# Altium project mcu_board.PrjPcb
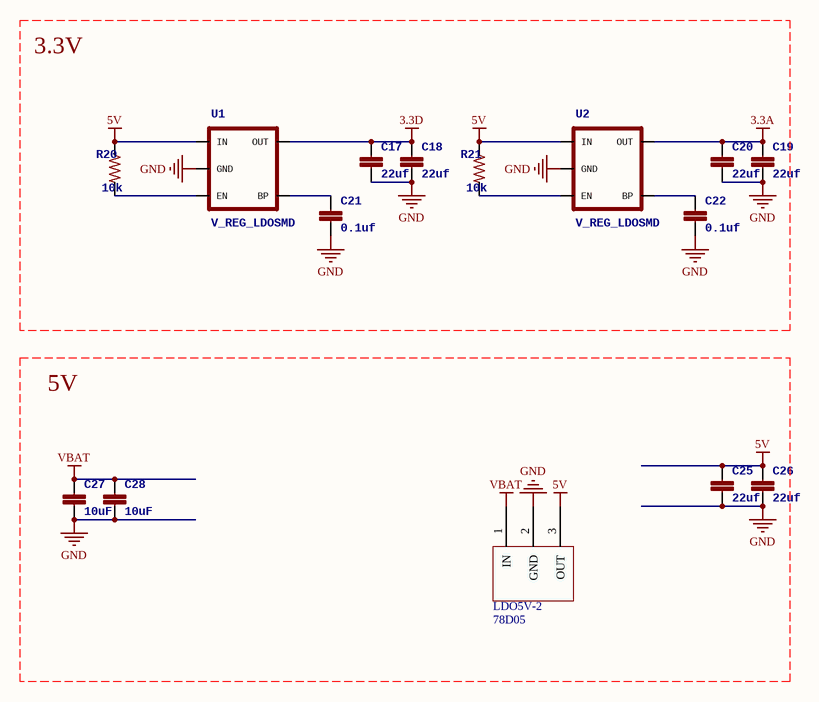
[diagram p0: power.SchDoc]
3 sheets, 75 parts. Net scope: flat (ports and power ports of the same name join across sheets).
Board file: mcu.PcbDoc
Sheets:
  power.SchDoc
  mcu.SchDoc
  interface.SchDoc

## Sheet power.SchDoc
size A4

### Parts
C17  22uf  [0805]
C18  22uf  [0805]
C19  22uf  [0805]
C20  22uf  [0805]
C21  0.1uf  [0603]
C22  0.1uf  [0603]
C25  22uf  [0805]
C26  22uf  [0805]
C27  10uF  [1206]
C28  10uF  [1206]
LDO5V-2  78D05  [TO-252-2L]
R20  10k  [0603]
R21  10k  [0603]
U1  V_REG_LDOSMD  [SOT23-5]
U2  V_REG_LDOSMD  [SOT23-5]

### Nets
3.3A: C19.1 C20.1 U2.5(OUT)
3.3D: C17.1 C18.1 U1.5(OUT)
5V: C25.1 C26.1 LDO5V-2.3(OUT) R20.1 R21.1 U1.1(IN) U2.1(IN)
GND: C17.2 C18.2 C19.2 C20.2 C21.2 C22.2 C25.2 C26.2 C27.2 C28.2 LDO5V-2.2(GND) U1.2(GND) U2.2(GND)
VBAT: C27.1 C28.1 LDO5V-2.1(IN)
NetC21_1: C21.1 U1.4(BP)
NetC22_1: C22.1 U2.4(BP)
NetR20_2: R20.2 U1.3(EN)
NetR21_2: R21.2 U2.3(EN)

### Notes on the sheet
- 3.3V
- 5V

### Library data of the parts
C17-C22 C25-C28 = CAP0402-CAP: 电容; PARTNO: CC0402ZRY5V7BB104
R20 R21 = RESISTOR0402-RES: 电阻
U1 U2 = V_REG_LDOSMD: <b>Voltage Regulator LDO</b> / Standard 150mA LDO voltage regulator in SOT-23 layout. Micrel part MIC5205. BP (by-pass) pin is used to lower output noise with 470pF cap.; PARTNO: MIC5207-3.3YM5

## Sheet mcu.SchDoc
size A4
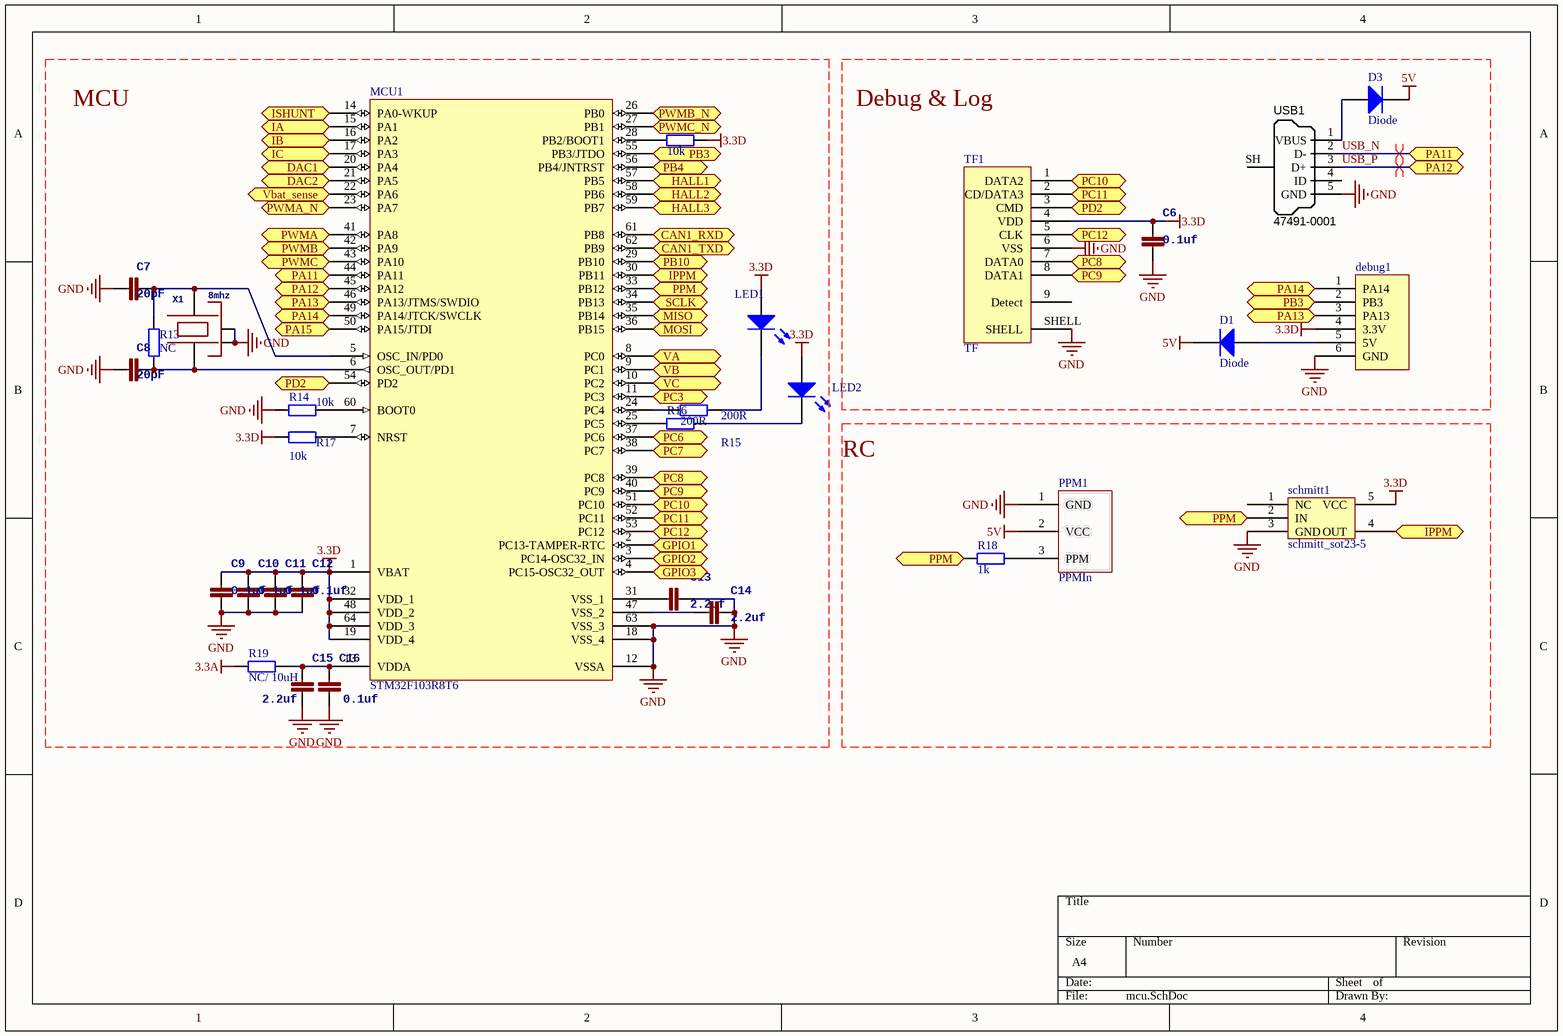
[diagram p1: mcu.SchDoc]

### Parts
C6  0.1uf  [0603]
C7  20pF  [0603]
C8  20pF  [0603]
C9  0.1uf  [0603]
C10  0.1uf  [0603]
C11  0.1uf  [0603]
C12  0.1uf  [0603]
C13  2.2uf  [0603]
C14  2.2uf  [0603]
C15  2.2uf  [0603]
C16  0.1uf  [0603]
D1  Diode  [0805]
D3  Diode  [0805]
debug1  debug  [WFRSM125]  (value not drawn)
LED1  LED0  [0603]  (value not drawn)
LED2  LED0  [0603]  (value not drawn)
MCU1  STM32F103R8T6  [LQFP64_N]
PPM1  PPMIn  [ServoConnector]
R12  10k  [0603]
R13  NC  [0603]
R14  10k  [0603]
R15  200R  [0603]
R16  200R  [0603]
R17  10k  [0603]
R18  1k  [0603]
R19  NC/ 10uH  [0603]
schmitt1  schmitt_sot23-5  [SOT23-5]
TF1  TF  [TF]
USB1  Manufacturer Part Number 1: 47491-0001  [MOLEX-47346-0001]  (hidden comment: USB Micro Type B)
X1  8mhz  [OSCILLATOR-3.2X2.5]

### Ports
CAN1_RXD, CAN1_TXD, DAC1, DAC2, GPIO1, GPIO2, GPIO3, HALL1, HALL2, HALL3, IA, IB, IC, IPPM, ISHUNT, MISO, MOSI, PA11, PA12, PA13, PA14, PA15, PB3, PB4, PB10, PC3, PC6, PC7, PC8, PC9, PC10, PC11, PC12, PD2, PPM, PWMA, PWMA_N, PWMB, PWMB_N, PWMC, PWMC_N, SCLK, VA, VB, Vbat_sense, VC

### Nets
3.3A: R19.2
3.3D: C6.2 C9.2 C10.2 C11.2 C12.2 debug1.4(3.3V) LED1.1(A) LED2.1(A) MCU1.1(VBAT) MCU1.19(VDD_4) MCU1.32(VDD_1) MCU1.48(VDD_2) MCU1.64(VDD_3) R12.2 R17.2 schmitt1.5(VCC) TF1.4(VDD)
5V: D1.2(K) D3.2(K) PPM1.2(VCC)
GND: C6.1 C7.2 C8.2 C9.1 C10.1 C11.1 C12.1 C13.2 C14.2 C15.1 C16.1 debug1.6(GND) MCU1.12(VSSA) MCU1.18(VSS_4) MCU1.63(VSS_3) PPM1.1(GND) R14.1 schmitt1.3(GND) TF1.6(VSS) TF1.SHELL USB1.5(GND) X1.2(NC_2) X1.4(NC_4)
USB_N: MCU1.44(PA11) USB1.2(D-) ; port PA11
USB_P: MCU1.45(PA12) USB1.3(D+) ; port PA12
Net*1_1: MCU1.3(PC14-OSC32_IN) ; port GPIO2
Net*1_2: MCU1.4(PC15-OSC32_OUT) ; port GPIO3
Net*1_3: MCU1.41(PA8) ; port PWMA
Net*1_4: MCU1.42(PA9) ; port PWMB
Net*1_5: MCU1.43(PA10) ; port PWMC
Net*1_6: MCU1.23(PA7) ; port PWMA_N
Net*1_7: MCU1.26(PB0) ; port PWMB_N
Net*1_8: MCU1.27(PB1) ; port PWMC_N
Net*1_9: MCU1.34(PB13) ; port SCLK
Net*1_10: MCU1.35(PB14) ; port MISO
Net*1_11: MCU1.36(PB15) ; port MOSI
Net*1_15: MCU1.17(PA3) ; port IC
Net*1_16: MCU1.16(PA2) ; port IB
Net*1_17: MCU1.15(PA1) ; port IA
Net*1_18: MCU1.14(PA0-WKUP) ; port ISHUNT
Net*1_25: MCU1.57(PB5) ; port HALL1
Net*1_26: MCU1.58(PB6) ; port HALL2
Net*1_27: MCU1.59(PB7) ; port HALL3
Net*1_28: MCU1.2(PC13-TAMPER-RTC) ; port GPIO1
NetC1_1: MCU1.8(PC0) ; port VA
NetC2_1: MCU1.9(PC1) ; port VB
NetC3_1: MCU1.10(PC2) ; port VC
NetC4_1: MCU1.22(PA6) ; port Vbat_sense
NetC7_1: C7.1 MCU1.5(OSC_IN/PD0) R13.2 X1.3
NetC8_1: C8.1 MCU1.6(OSC_OUT/PD1) R13.1 X1.1
NetC13_1: C13.1 MCU1.31(VSS_1)
NetC14_1: C14.1 MCU1.47(VSS_2)
NetC15_2: C15.2 C16.2 MCU1.13(VDDA) R19.1
NetD1_1: D1.1(A) debug1.5(5V)
NetD3_1: D3.1(A) USB1.1(VBUS)
NetDAC1_1: MCU1.20(PA4) ; port DAC1
NetDAC2_1: MCU1.21(PA5) ; port DAC2
Netdebug1_1: debug1.1(PA14) MCU1.49(PA14/JTCK/SWCLK) ; port PA14
Netdebug1_2: debug1.2(PB3) MCU1.55(PB3/JTDO) ; port PB3
Netdebug1_3: debug1.3(PA13) MCU1.46(PA13/JTMS/SWDIO) ; port PA13
NetLED1_2: LED1.2(K) R15.2
NetLED2_2: LED2.2(K) R16.2
NetMCU1_7: MCU1.7(NRST) R17.1
NetMCU1_11: MCU1.11(PC3) ; port PC3
NetMCU1_24: MCU1.24(PC4) R15.1
NetMCU1_25: MCU1.25(PC5) R16.1
NetMCU1_28: MCU1.28(PB2/BOOT1) R12.1
NetMCU1_29: MCU1.29(PB10) ; port PB10
NetMCU1_30: MCU1.30(PB11) schmitt1.4(OUT) ; port IPPM
NetMCU1_33: MCU1.33(PB12) R18.2 schmitt1.2(IN) ; port PPM
NetMCU1_37: MCU1.37(PC6) ; port PC6
NetMCU1_38: MCU1.38(PC7) ; port PC7
NetMCU1_39: MCU1.39(PC8) TF1.7(DATA0) ; port PC8
NetMCU1_40: MCU1.40(PC9) TF1.8(DATA1) ; port PC9
NetMCU1_50: MCU1.50(PA15/JTDI) ; port PA15
NetMCU1_51: MCU1.51(PC10) TF1.1(DATA2) ; port PC10
NetMCU1_52: MCU1.52(PC11) TF1.2(CD/DATA3) ; port PC11
NetMCU1_53: MCU1.53(PC12) TF1.5(CLK) ; port PC12
NetMCU1_54: MCU1.54(PD2) TF1.3(CMD) ; port PD2
NetMCU1_56: MCU1.56(PB4/JNTRST) ; port PB4
NetMCU1_60: MCU1.60(BOOT0) R14.2
NetMCU1_61: MCU1.61(PB8) ; port CAN1_RXD
NetMCU1_62: MCU1.62(PB9) ; port CAN1_TXD
NetPPM1_3: PPM1.3(PPM) R18.1

Not connected (* = marked no-connect by the designer): schmitt1 1(NC); TF1 9(Detect); USB1 4(ID) SH(Shell)

### Layout directives
differential pair: USB_N, USB_P

### Notes on the sheet
- MCU
- Debug & Log
- RC

### Library data of the parts
C6-C16 = CAP0402-CAP: 电容; PARTNO: CC0402ZRY5V7BB104
D1 D3 = Diode: Default Diode; Published: 8-Jun-2000; LatestRevisionDate: 17-Jul-2002; LatestRevisionNote: Re-released for DXP Platform.; PackageVersion: Sep-1996; PackageReference: SMC; Publisher: Altium Limited; PackageDescription: DO-214-AB/SMC; 2 C-Bend Leads; Body 7.9 x 5.9 mm, inc. leads (LxW); Code_JEDEC: DO-214-AB
LED1 LED2 = LED0: Typical INFRARED GaAs LED; Published: 8-Jun-2000; LatestRevisionDate: 08-Jul-2005; LatestRevisionNote: Mech Layer 1 removed.; PackageReference: LED-0; Publisher: Altium Limited; PackageDescription: LED; 2 Leads
MCU1 = STM32F103R8T6: STM32 ARM-based 32-bit MCU with 64 Kbytes Flash, 64-pin LQFP, Industrial Temperature; Published: *; DatasheetVersion: *; PackageVersion: *; PackageReference: *; Publisher: *; PackageDescription: *; ComponentLink1Description: *; ComponentLink1URL: *; ComponentLink2Description: *; ComponentLink2URL: *
R12-R19 = Res2: 电阻; Value: 0Ohm; Published: 8-Jun-2000; LatestRevisionDate: 17-Jul-2002; LatestRevisionNote: Re-released for DXP Platform.; PackageReference: AXIAL-0.4; Publisher: Altium Limited; PackageDescription: Axial Device, Thru-Hole; 2 Leads; 0.4 in Pin Spacing
USB1 = USB_Micro_TypeB: Connector SMD USB Micro Type B middle mount; Manufacturer 1: Molex Inc; SCDType: undef; Package / Case: SMD; Supplier 1: Digi-Key; Supplier Part Number 1: WM17142CT-ND
X1 = OSCILLATOR-3.2X2.5: Crystal Oscillator in 3.2x2.5 SMD

## Sheet interface.SchDoc
size A4
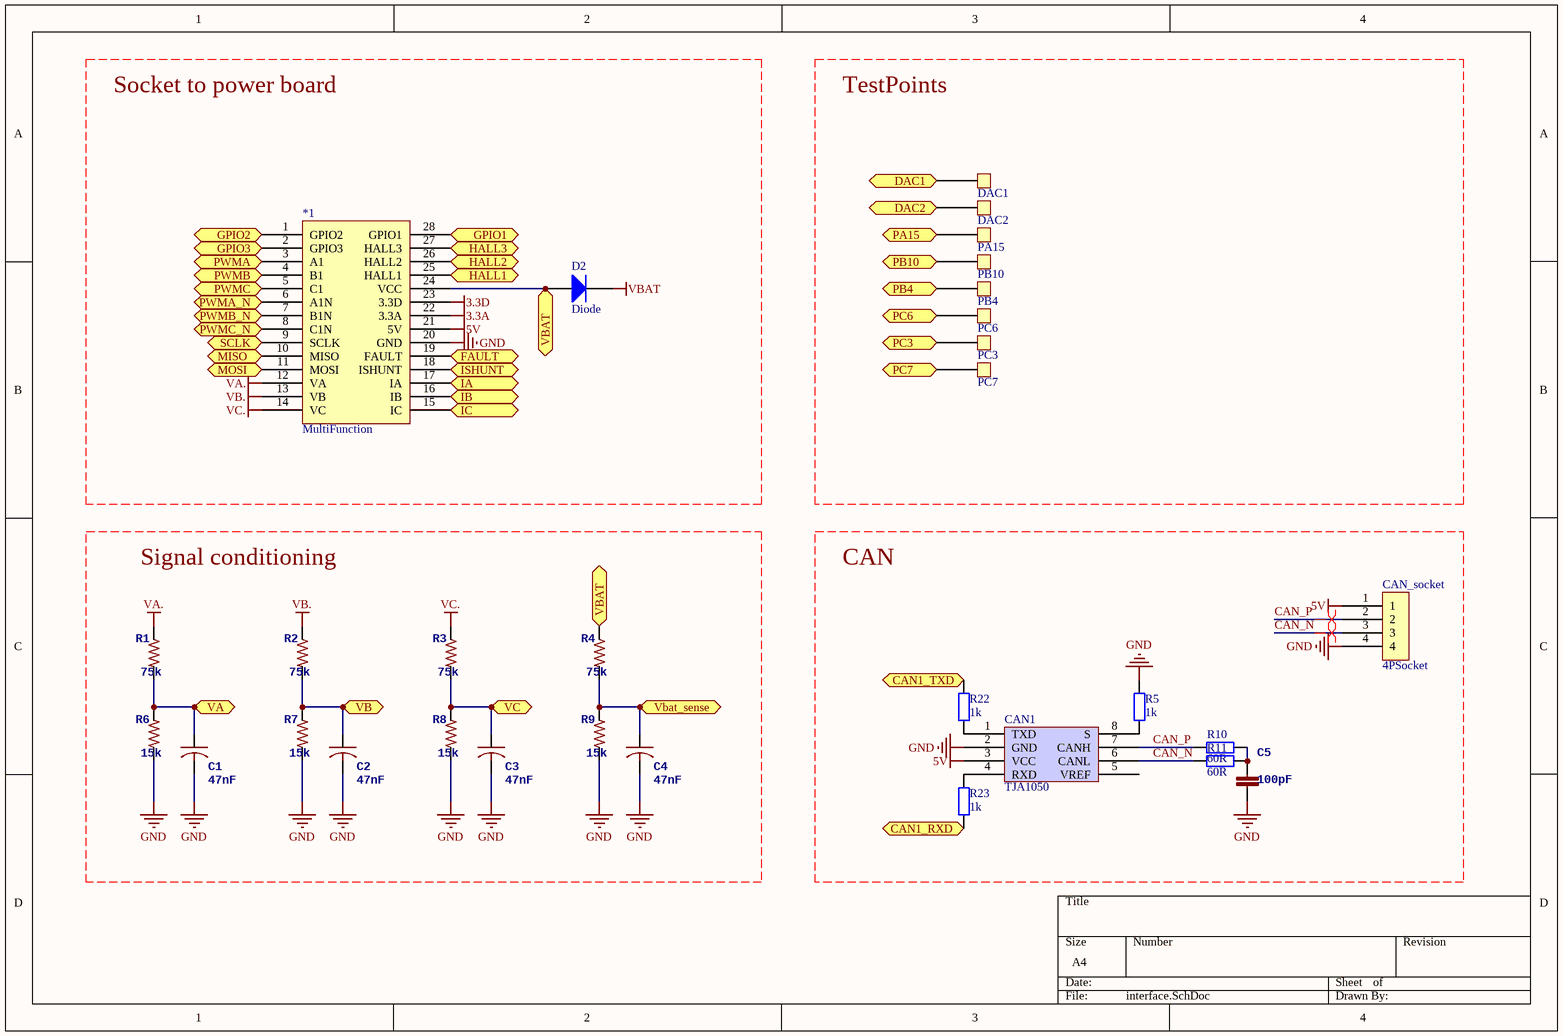
[diagram p2: interface.SchDoc]

### Parts
*1  MultiFunction  [MultiFunction]
C1  47nF  [0603]
C2  47nF  [0603]
C3  47nF  [0603]
C4  47nF  [0603]
C5  100pF  [0603]
CAN1  TJA1050  [SOIC8_39MM]
CAN_socket  4PSocket  [4pSocket]
D2  Diode  [SMA]
DAC1  TestPad  [TestPad]  (value not drawn)
DAC2  TestPad  [TestPad]  (value not drawn)
PA15  TestPad  [TestPad]  (value not drawn)
PB4  TestPad  [TestPad]  (value not drawn)
PB10  TestPad  [TestPad]  (value not drawn)
PC3  TestPad  [TestPad]  (value not drawn)
PC6  TestPad  [TestPad]  (value not drawn)
PC7  TestPad  [TestPad]  (value not drawn)
R1  75k  [0603]
R2  75k  [0603]
R3  75k  [0603]
R4  75k  [0603]
R5  1k  [0603]
R6  15k  [0603]
R7  15k  [0603]
R8  15k  [0603]
R9  15k  [0603]
R10  60R  [0603]
R11  60R  [0603]
R22  1k  [0603]
R23  1k  [0603]

### Ports
CAN1_RXD, CAN1_TXD, DAC1, DAC2, FAULT, GPIO1, GPIO2, GPIO3, HALL1, HALL2, HALL3, IA, IB, IC, ISHUNT, MISO, MOSI, PA15, PB4, PB10, PC3, PC6, PC7, PWMA, PWMA_N, PWMB, PWMB_N, PWMC, PWMC_N, SCLK, VA, VB, VBAT, Vbat_sense, VC

### Nets
3.3A: *1.22(3.3A)
3.3D: *1.23(3.3D)
5V: *1.21(5V) CAN1.3(VCC) CAN_socket.1
GND: *1.20(GND) C1.2 C2.2 C3.2 C4.2 C5.1 CAN1.2(GND) CAN_socket.4 R5.2 R6.1 R7.1 R8.1 R9.1
VA.: *1.12(VA) R1.1
VB.: *1.13(VB) R2.1
VBAT: D2.2(K)
VC.: *1.14(VC) R3.1
CAN_N: CAN1.6(CANL) CAN_socket.3 R11.2
CAN_P: CAN1.7(CANH) CAN_socket.2 R10.2
Net*1_1: *1.1(GPIO2) ; port GPIO2
Net*1_2: *1.2(GPIO3) ; port GPIO3
Net*1_3: *1.3(A1) ; port PWMA
Net*1_4: *1.4(B1) ; port PWMB
Net*1_5: *1.5(C1) ; port PWMC
Net*1_6: *1.6(A1N) ; port PWMA_N
Net*1_7: *1.7(B1N) ; port PWMB_N
Net*1_8: *1.8(C1N) ; port PWMC_N
Net*1_9: *1.9(SCLK) ; port SCLK
Net*1_10: *1.10(MISO) ; port MISO
Net*1_11: *1.11(MOSI) ; port MOSI
Net*1_15: *1.15(IC) ; port IC
Net*1_16: *1.16(IB) ; port IB
Net*1_17: *1.17(IA) ; port IA
Net*1_18: *1.18(ISHUNT) ; port ISHUNT
Net*1_19: *1.19(FAULT) ; port FAULT
Net*1_24: *1.24(VCC) D2.1(A) R4.1 ; port VBAT
Net*1_25: *1.25(HALL1) ; port HALL1
Net*1_26: *1.26(HALL2) ; port HALL2
Net*1_27: *1.27(HALL3) ; port HALL3
Net*1_28: *1.28(GPIO1) ; port GPIO1
NetC1_1: C1.1 R1.2 R6.2 ; port VA
NetC2_1: C2.1 R2.2 R7.2 ; port VB
NetC3_1: C3.1 R3.2 R8.2 ; port VC
NetC4_1: C4.1 R4.2 R9.2 ; port Vbat_sense
NetC5_2: C5.2 R10.1 R11.1
NetCAN1_1: CAN1.1(TXD) R22.1
NetCAN1_4: CAN1.4(RXD) R23.2
NetCAN1_8: CAN1.8(S) R5.1
NetDAC1_1: DAC1.1 ; port DAC1
NetDAC2_1: DAC2.1 ; port DAC2
NetMCU1_11: PC3.1 ; port PC3
NetMCU1_29: PB10.1 ; port PB10
NetMCU1_37: PC6.1 ; port PC6
NetMCU1_38: PC7.1 ; port PC7
NetMCU1_50: PA15.1 ; port PA15
NetMCU1_56: PB4.1 ; port PB4
NetMCU1_61: R23.1 ; port CAN1_RXD
NetMCU1_62: R22.2 ; port CAN1_TXD

Not connected (* = marked no-connect by the designer): CAN1 5(VREF)

### Layout directives
differential pair: CAN_N, CAN_P

### Notes on the sheet
- Socket to power board
- TestPoints
- Signal conditioning
- CAN

### Library data of the parts
C1-C4 = C-USC0402: 电容
C5 = CAP0402-CAP: 电容; PARTNO: CC0402ZRY5V7BB104
D2 = Diode: Default Diode; Published: 8-Jun-2000; LatestRevisionDate: 17-Jul-2002; LatestRevisionNote: Re-released for DXP Platform.; PackageVersion: Sep-1996; PackageReference: SMC; Publisher: Altium Limited; PackageDescription: DO-214-AB/SMC; 2 C-Bend Leads; Body 7.9 x 5.9 mm, inc. leads (LxW); Code_JEDEC: DO-214-AB
R1-R4 R6-R9 = RESISTOR0402-RES: 电阻
R5 R10 R11 R22 R23 = Res2: 电阻; Value: 0Ohm; Published: 8-Jun-2000; LatestRevisionDate: 17-Jul-2002; LatestRevisionNote: Re-released for DXP Platform.; PackageReference: AXIAL-0.4; Publisher: Altium Limited; PackageDescription: Axial Device, Thru-Hole; 2 Leads; 0.4 in Pin Spacing

## Nets that join several sheets
3.3A: power (C19.1 C20.1 U2.5), mcu (R19.2), interface (*1.22)
3.3D: power (C17.1 C18.1 U1.5), mcu (17 pins), interface (*1.23)
5V: power (7 pins), mcu (D1.2 D3.2 PPM1.2), interface (*1.21 CAN1.3 CAN_socket.1)
GND: power (13 pins), mcu (23 pins), interface (13 pins)
VBAT: power (C27.1 C28.1 LDO5V-2.1), interface (D2.2)
Net*1_1: mcu (MCU1.3), interface (*1.1)
Net*1_2: mcu (MCU1.4), interface (*1.2)
Net*1_3: mcu (MCU1.41), interface (*1.3)
Net*1_4: mcu (MCU1.42), interface (*1.4)
Net*1_5: mcu (MCU1.43), interface (*1.5)
Net*1_6: mcu (MCU1.23), interface (*1.6)
Net*1_7: mcu (MCU1.26), interface (*1.7)
Net*1_8: mcu (MCU1.27), interface (*1.8)
Net*1_9: mcu (MCU1.34), interface (*1.9)
Net*1_10: mcu (MCU1.35), interface (*1.10)
Net*1_11: mcu (MCU1.36), interface (*1.11)
Net*1_15: mcu (MCU1.17), interface (*1.15)
Net*1_16: mcu (MCU1.16), interface (*1.16)
Net*1_17: mcu (MCU1.15), interface (*1.17)
Net*1_18: mcu (MCU1.14), interface (*1.18)
Net*1_25: mcu (MCU1.57), interface (*1.25)
Net*1_26: mcu (MCU1.58), interface (*1.26)
Net*1_27: mcu (MCU1.59), interface (*1.27)
Net*1_28: mcu (MCU1.2), interface (*1.28)
NetC1_1: mcu (MCU1.8), interface (C1.1 R1.2 R6.2)
NetC2_1: mcu (MCU1.9), interface (C2.1 R2.2 R7.2)
NetC3_1: mcu (MCU1.10), interface (C3.1 R3.2 R8.2)
NetC4_1: mcu (MCU1.22), interface (C4.1 R4.2 R9.2)
NetDAC1_1: mcu (MCU1.20), interface (DAC1.1)
NetDAC2_1: mcu (MCU1.21), interface (DAC2.1)
NetMCU1_11: mcu (MCU1.11), interface (PC3.1)
NetMCU1_29: mcu (MCU1.29), interface (PB10.1)
NetMCU1_37: mcu (MCU1.37), interface (PC6.1)
NetMCU1_38: mcu (MCU1.38), interface (PC7.1)
NetMCU1_50: mcu (MCU1.50), interface (PA15.1)
NetMCU1_56: mcu (MCU1.56), interface (PB4.1)
NetMCU1_61: mcu (MCU1.61), interface (R23.1)
NetMCU1_62: mcu (MCU1.62), interface (R22.2)